# Altium schematic sheet SSR Control.SchDoc: SSR Control
size A4; DocumentNumber: 3; SheetNumber: 3; SheetTotal: 9
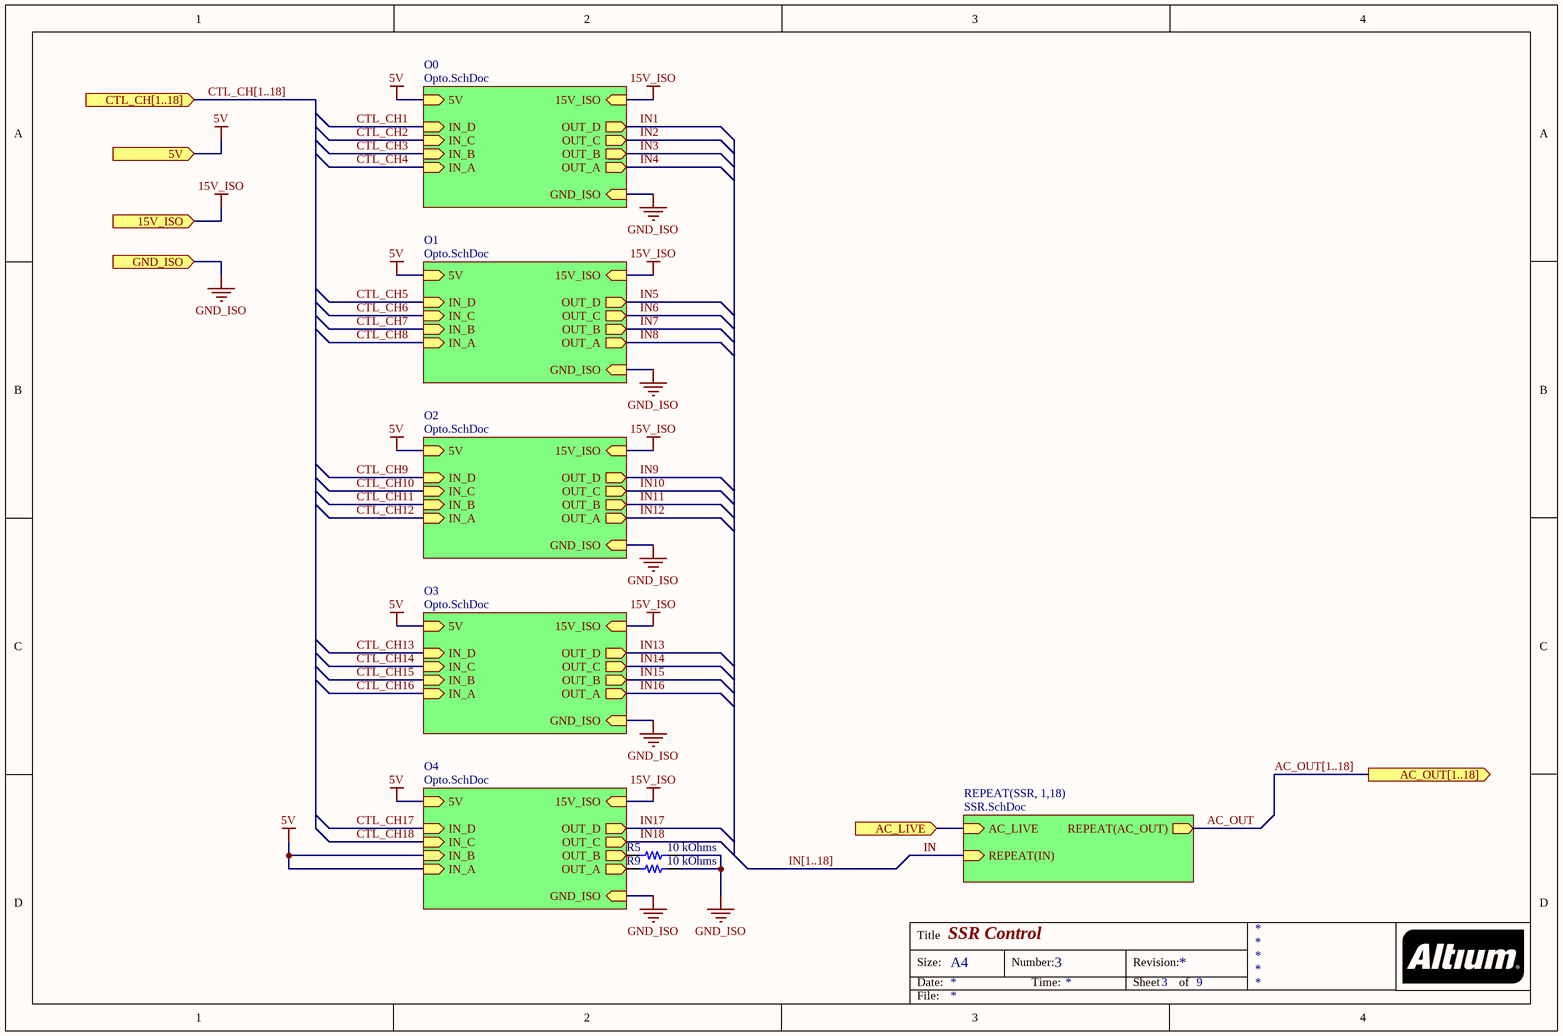
[diagram p0: SSR Control.SchDoc]

## Parts
R5  10 kOhms  [RES 0603_1608]
R9  10 kOhms  [RES 0603_1608]

## Sub-sheets
O0 = Opto.SchDoc: IN_A (in), IN_D (in), IN_C (in), IN_B (in), OUT_C (out), OUT_D (out), OUT_B (out), OUT_A (out), 5V (in), 15V_ISO (in), GND_ISO (in)
O1 = Opto.SchDoc: IN_A (in), IN_D (in), IN_C (in), IN_B (in), OUT_C (out), OUT_D (out), OUT_B (out), OUT_A (out), 5V (in), 15V_ISO (in), GND_ISO (in)
O2 = Opto.SchDoc: IN_A (in), IN_D (in), IN_C (in), IN_B (in), OUT_C (out), OUT_D (out), OUT_B (out), OUT_A (out), 5V (in), 15V_ISO (in), GND_ISO (in)
O3 = Opto.SchDoc: IN_A (in), IN_D (in), IN_C (in), IN_B (in), OUT_C (out), OUT_D (out), OUT_B (out), OUT_A (out), 5V (in), 15V_ISO (in), GND_ISO (in)
O4 = Opto.SchDoc: IN_A (in), IN_D (in), IN_C (in), IN_B (in), OUT_C (out), OUT_D (out), OUT_B (out), OUT_A (out), 5V (in), 15V_ISO (in), GND_ISO (in)
REPEAT(SSR, 1,18) = SSR.SchDoc: AC_LIVE (in), REPEAT(AC_OUT) (out), REPEAT(IN) (in)

## Ports
5V (in, see Review[3A], AC Detection[1A], Connectors[3A], Opto[1B], Supply 5V[2B], Supply 15V[2B]), 15V_ISO (in, see Review[3A], Opto[2B]), AC_LIVE (in, see Review[3A], AC Detection[3B], SSR[2B]), AC_OUT[1..18] (out, see Review[3A], AC Connectors[2A]), CTL_CH[1..18] (in, see Review[3B], Connectors[3A]), GND_ISO (in, see Review[3B], Opto[2B], Supply 5V[3C])

## Nets
5V: port 5V, sheet O0/5V, sheet O1/5V, sheet O2/5V, sheet O3/5V, sheet O4/IN_A, sheet O4/IN_B, sheet O4/5V
15V_ISO: port 15V_ISO, sheet O0/15V_ISO, sheet O1/15V_ISO, sheet O2/15V_ISO, sheet O3/15V_ISO, sheet O4/15V_ISO
GND_ISO: R5.2 R9.2 ; port GND_ISO, sheet O0/GND_ISO, sheet O1/GND_ISO, sheet O2/GND_ISO, sheet O3/GND_ISO, sheet O4/GND_ISO
AC_LIVE: port AC_LIVE, sheet REPEAT(SSR, 1,18)/AC_LIVE
AC_OUT: sheet REPEAT(SSR, 1,18)/REPEAT(AC_OUT)
CTL_CH1: sheet O0/IN_D
CTL_CH2: sheet O0/IN_C
CTL_CH3: sheet O0/IN_B
CTL_CH4: sheet O0/IN_A
CTL_CH5: sheet O1/IN_D
CTL_CH6: sheet O1/IN_C
CTL_CH7: sheet O1/IN_B
CTL_CH8: sheet O1/IN_A
CTL_CH9: sheet O2/IN_D
CTL_CH10: sheet O2/IN_C
CTL_CH11: sheet O2/IN_B
CTL_CH12: sheet O2/IN_A
CTL_CH13: sheet O3/IN_D
CTL_CH14: sheet O3/IN_C
CTL_CH15: sheet O3/IN_B
CTL_CH16: sheet O3/IN_A
CTL_CH17: sheet O4/IN_D
CTL_CH18: sheet O4/IN_C
IN: sheet REPEAT(SSR, 1,18)/REPEAT(IN)
IN1: sheet O0/OUT_D
IN2: sheet O0/OUT_C
IN3: sheet O0/OUT_B
IN4: sheet O0/OUT_A
IN5: sheet O1/OUT_D
IN6: sheet O1/OUT_C
IN7: sheet O1/OUT_B
IN8: sheet O1/OUT_A
IN9: sheet O2/OUT_D
IN10: sheet O2/OUT_C
IN11: sheet O2/OUT_B
IN12: sheet O2/OUT_A
IN13: sheet O3/OUT_D
IN14: sheet O3/OUT_C
IN15: sheet O3/OUT_B
IN16: sheet O3/OUT_A
IN17: sheet O4/OUT_D
IN18: sheet O4/OUT_C
NetR5_1: R5.1 ; sheet O4/OUT_B
NetR9_1: R9.1 ; sheet O4/OUT_A

## Buses and harness runs
bus AC_OUT[1..18] = port AC_OUT[1..18]
bus CTL_CH[1..18] = port CTL_CH[1..18]
bus IN[1..18]

## Notes on the sheet
- Title
- Size:
- Date:
- A4
- Number:
- Time:
- Revision:
- Sheet
- of
- File:

## Library data of the parts
R5 R9 = SG73S1JTTD1002F: RES 10K OHM 1% 1/5W 0603; Manufacturer: KOA Speer Electronics, Inc.; Power (Watts): 0.2W, 1/5W; Temperature Coefficient: ±100ppm/°C; Part Number: SG73S1JTTD1002F; Value: 10 kOhms; ComponentLink1Description: Datasheet; ComponentLink1URL: http://www.koaspeer.com/catimages/Products/SG73S/SG73S.pdf; ComponentLink2Description: DigiKey Link; ComponentLink2URL: https://www.digikey.com/en/products/detail/koa-speer-electronics-inc/SG73S1JTTD1002F/10279969; Composition: Thick Film; Device Package: 0603 (1608 Metric); Features: Automotive AEC-Q200, Moisture Resistant, Pulse Withstanding; Height - Seated (Max): 0.022" (0.55mm); LastUpdated: 6/13/2023 8:14:59 PM; Lifecycle Status: Active; Minimum Order: 1; Number of Terminations: 2; Operating Temperature: -55°C ~ 155°C; Package / Case: 0603 (1608 Metric); Packaging: TapeAndReel; PartId: 5386; Part Status: Active; Price: 0.01; Ratings: AEC-Q200; Resistance: 10 kOhms; Series: SG73S; Size / Dimension: 0.063" L x 0.031" W (1.60mm x 0.80mm); Supplier 1: DigiKey; Supplier Part Number 1: 2019-SG73S1JTTD1002FCT-ND; Supplier Device Package: 0603; Tolerance: ±1%